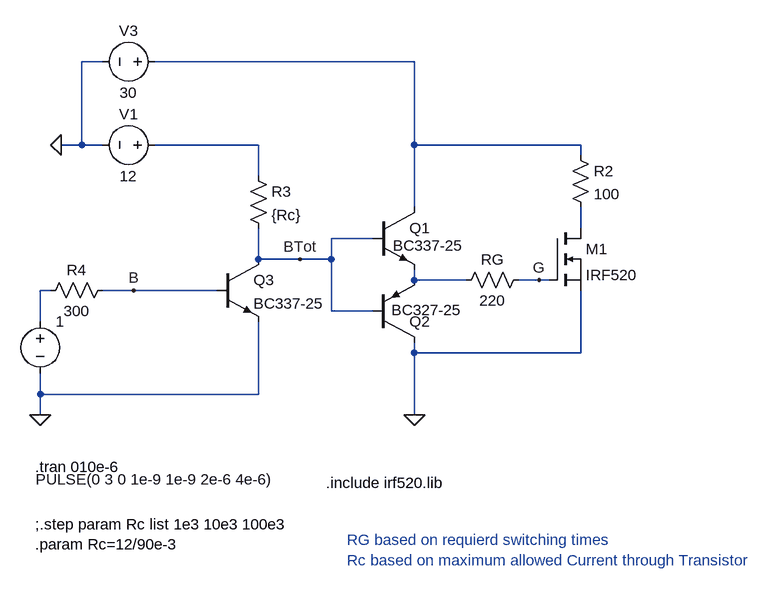
[diagram p0: schematic 400_PushPull.asc]
400_PushPull.asc, the LTspice schematic file:
Version 4
SHEET 1 880 680
WIRE -224 -160 -256 -160
WIRE 256 -160 -144 -160
WIRE -256 -32 -256 -160
WIRE -256 -32 -288 -32
WIRE -224 -32 -256 -32
WIRE 16 -32 -144 -32
WIRE 256 -32 256 -160
WIRE 512 -32 256 -32
WIRE 512 -16 512 -32
WIRE 16 16 16 -32
WIRE 256 64 256 -32
WIRE 512 96 512 64
WIRE 192 112 128 112
WIRE 16 144 16 96
WIRE 80 144 16 144
WIRE 128 144 128 112
WIRE 128 144 80 144
WIRE 256 176 256 160
WIRE 336 176 256 176
WIRE 448 176 416 176
WIRE 464 176 448 176
WIRE -304 192 -320 192
WIRE -176 192 -224 192
WIRE -48 192 -176 192
WIRE 128 224 128 144
WIRE 192 224 128 224
WIRE -320 240 -320 192
WIRE 256 288 256 272
WIRE 512 288 512 192
WIRE 512 288 256 288
WIRE -320 352 -320 320
WIRE 16 352 16 240
WIRE 16 352 -320 352
WIRE -320 384 -320 352
WIRE 256 384 256 288
FLAG 256 384 0
FLAG -288 -32 0
FLAG -320 384 0
FLAG 448 176 G
FLAG 80 144 BTot
FLAG -176 192 B
SYMBOL npn 192 64 R0
WINDOW 3 31 59 Left 2
SYMATTR Value BC337-25
SYMATTR InstName Q1
SYMBOL pnp 192 272 M180
WINDOW 3 29 50 Left 2
SYMATTR Value BC327-25
SYMATTR InstName Q2
SYMBOL nmos 464 96 R0
SYMATTR InstName M1
SYMATTR Value IRF520
SYMATTR Prefix X
SYMBOL res 432 160 R90
WINDOW 0 0 56 VBottom 2
WINDOW 3 32 56 VTop 2
SYMATTR InstName RG
SYMATTR Value 220
SYMBOL voltage -128 -32 R90
WINDOW 0 -32 56 VBottom 2
WINDOW 3 32 56 VTop 2
WINDOW 123 0 0 Left 0
WINDOW 39 0 0 Left 0
SYMATTR InstName V1
SYMATTR Value 12
SYMBOL voltage -320 224 R0
WINDOW 3 -7 259 Left 2
WINDOW 123 0 0 Left 0
WINDOW 39 0 0 Left 0
SYMATTR Value PULSE(0 3 0 1e-9 1e-9 2e-6 4e-6)
SYMATTR InstName 1
SYMBOL res 496 -32 R0
SYMATTR InstName R2
SYMATTR Value 100
SYMBOL npn -48 144 R0
SYMATTR InstName Q3
SYMATTR Value BC337-25
SYMBOL res 0 0 R0
SYMATTR InstName R3
SYMATTR Value {Rc}
SYMBOL res -208 176 R90
WINDOW 0 0 56 VBottom 2
WINDOW 3 32 56 VTop 2
SYMATTR InstName R4
SYMATTR Value 300
SYMBOL voltage -128 -160 R90
WINDOW 0 -32 56 VBottom 2
WINDOW 3 32 56 VTop 2
WINDOW 123 0 0 Left 0
WINDOW 39 0 0 Left 0
SYMATTR InstName V3
SYMATTR Value 30
TEXT -328 464 Left 2 !.tran 010e-6
TEXT 120 488 Left 2 !.include irf520.lib
TEXT -328 552 Left 2 !;.step param Rc list 1e3 10e3 100e3\n.param Rc=12/90e-3
TEXT 152 576 Left 2 ;RG based on requierd switching times\nRc based on maximum allowed Current through Transistor

The netlist it stands for:
* 400_PushPull.asc
Q1 N001 BTot N004 0 BC337-25
Q2 0 BTot N004 0 BC327-25
XM1 N003 G 0 IRF520  ; pins D G S
RG G N004 220
V1 N002 0 12
V§1 N005 0 PULSE(0 3 0 1e-9 1e-9 2e-6 4e-6)
R2 N001 N003 100
Q3 BTot B 0 0 BC337-25
R3 N002 BTot {Rc}
R4 B N005 300
V3 N001 0 30
.model NPN NPN
.model PNP PNP
.lib standard.bjt
.tran 010e-6
.include irf520.lib
;.step param Rc list 1e3 10e3 100e3
.param Rc=12/90e-3
* RG based on requierd switching times
* Rc based on maximum allowed Current through Transistor
.backanno
.end